# EAGLE design zik-pcb-sbc-ez80stm100p-r3-shield-r1 (EAGLE 6.5.0)
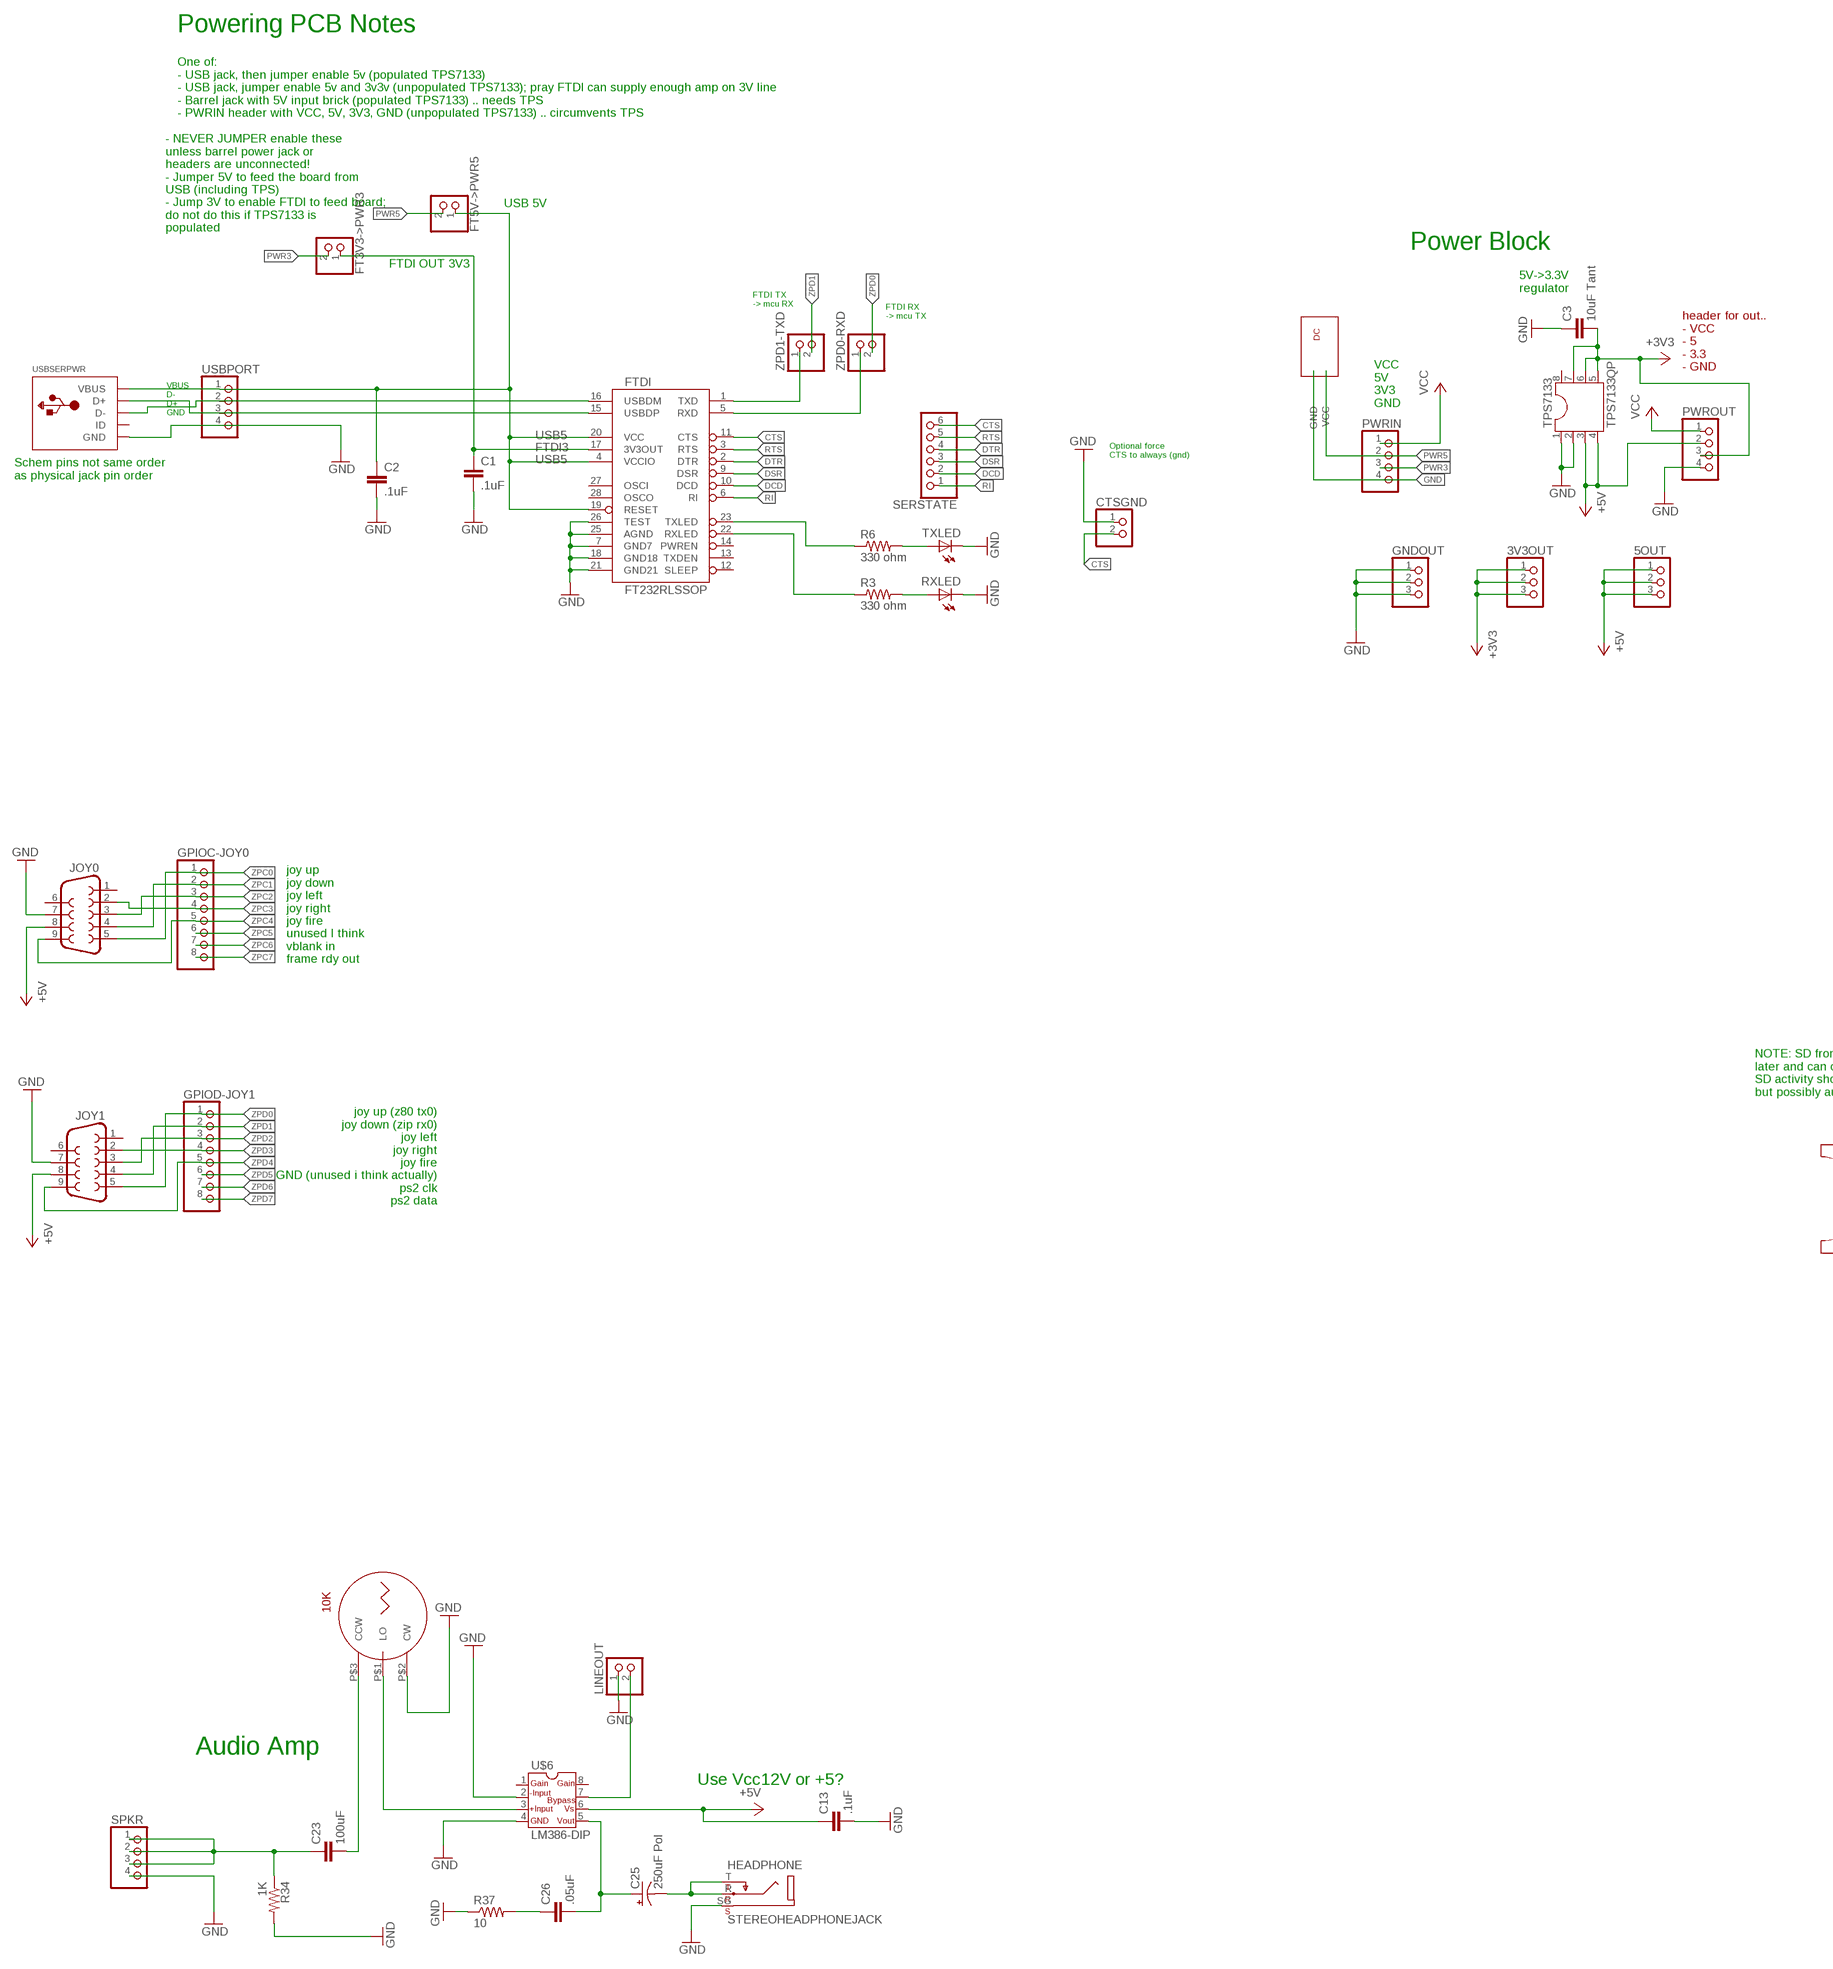
[diagram p0: schematic, sheet 1, part 1 of 3]
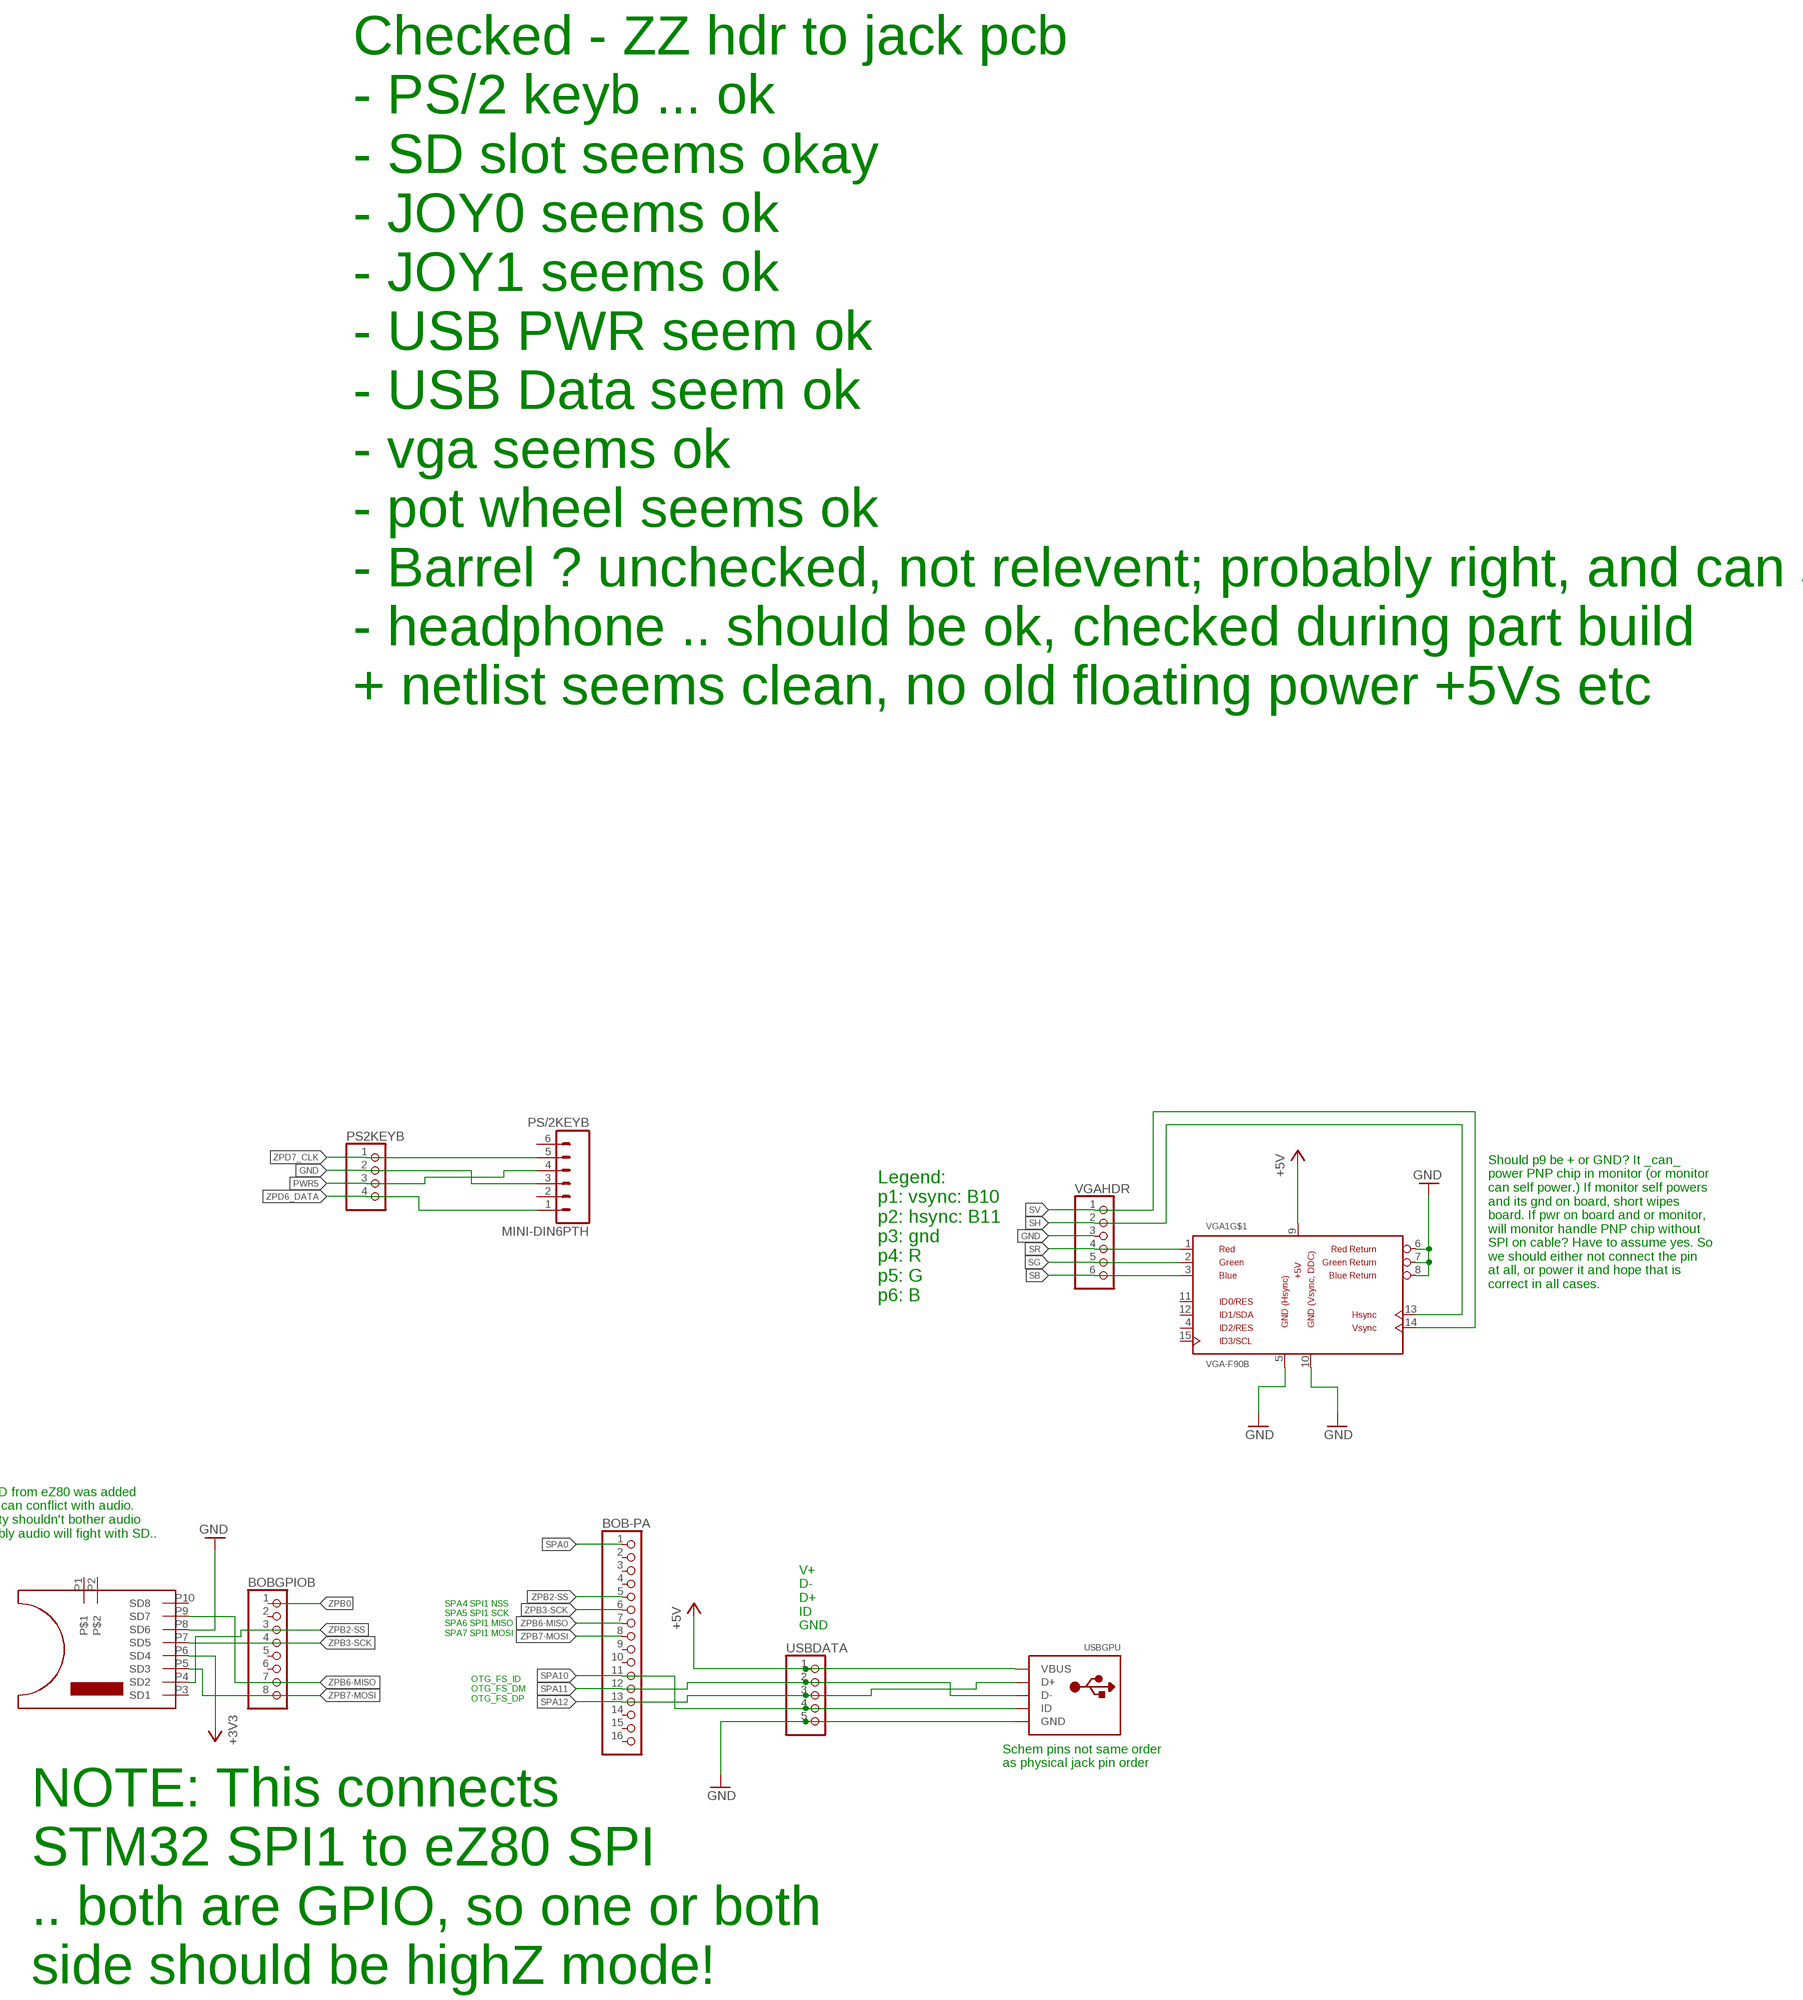
[diagram p1: schematic, sheet 1, part 2 of 3]
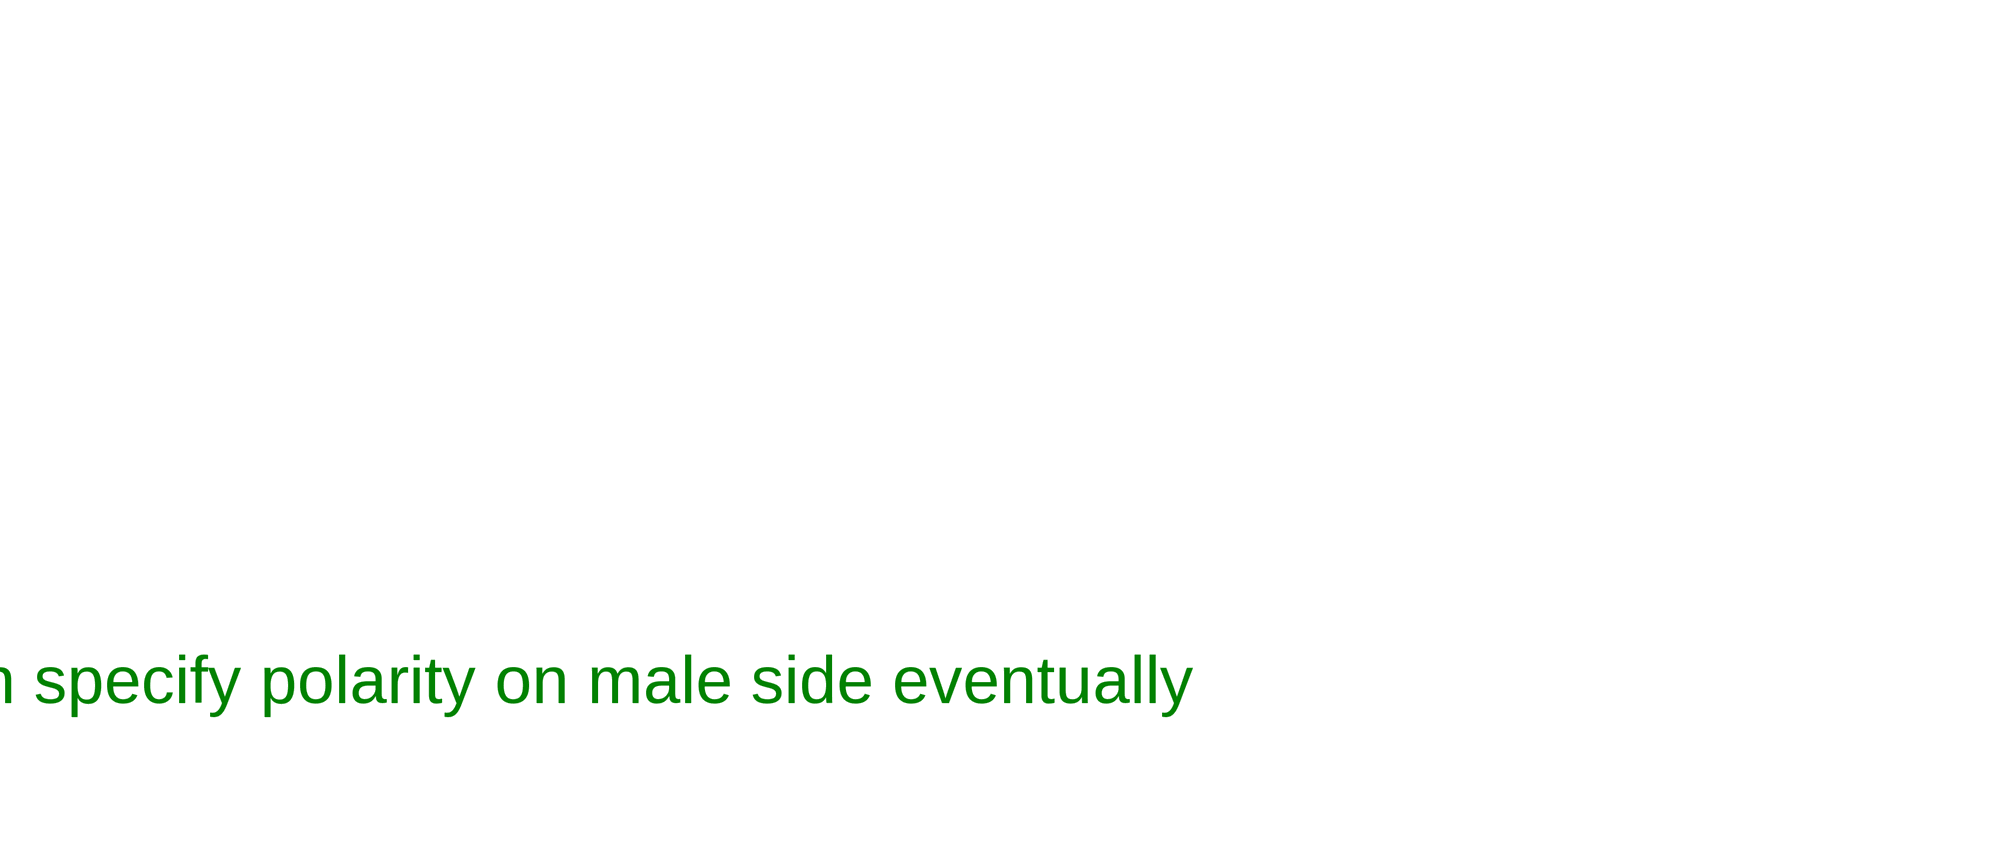
[diagram p2: schematic, sheet 1, part 3 of 3]

## Parts
3V3OUT  PINHD-1X3  [1X03]
5OUT  PINHD-1X3  [1X03]
BARREL  DCJACKZIK  [DCJACKZIK]
BOB-PA  PINHD-1X16  [1X16]
BOBGPIOB  PINHD-1X8  [1X08]
C1  .1uF  C-EU025-025X050  [C025-025X050]
C2  .1uF  C-EU025-025X050  [C025-025X050]
C3  10uF Tant  C-EU025-025X050  [C025-025X050]
C13  .1uF  C-EU025-025X050  [C025-025X050]
C23  100uF  C-EU025-025X050  [C025-025X050]
C25  250uF Pol  CPOL-USE3.5-8  [E3,5-8]
C26  .05uF  C-EU025-025X050  [C025-025X050]
CTSGND  PINHD-1X2  [1X02]
FT3V3->PWR3  PINHD-1X2  [1X02]
FT5V->PWR5  PINHD-1X2  [1X02]
FTDI  FT232RLSSOP  [SSOP28DB]
GNDOUT  PINHD-1X3  [1X03]
GPIOC-JOY0  PINHD-1X8  [1X08]
GPIOD-JOY1  PINHD-1X8  [1X08]
HEADPHONE  STEREOHEADPHONEJACK  [STEREOHEADPHONEJACK]
JOY0  DB9FEMALE  [DB9]
JOY1  DB9FEMALE  [DB9]
LINEOUT  PINHD-1X2  [1X02]
PS2KEYB  PINHD-1X4  [1X04]
PS/2KEYB  MINI-DIN6PTH  [MINI-DIN6]
PWRIN  PINHD-1X4  [1X04]
PWROUT  PINHD-1X4  [1X04]
R3  330 ohm  R-US_0204/7  [0204/7]
R6  330 ohm  R-US_0204/7  [0204/7]
R34  1K  R-US_0204/7  [0204/7]
R37  10  R-US_0204/7  [0204/7]
RXLED  LED5MM  [LED5MM]
SERSTATE  PINHD-1X6  [1X06]
SPKR  PINHD-1X4  [1X04]
TPS7133  TPS7133QP  DIL8  [DIL08]
TXLED  LED5MM  [LED5MM]
U$2  MICROSD10  [MICROSD10]
U$3  10K  POTWHEEL  [POTWHEEL]
U$6  LM386-DIP  [LM386-DIP8]
USBDATA  PINHD-1X5  [1X05]
USBGPU  USBMICRO_20329  [4UCONN_20329]
USBPORT  PINHD-1X4  [1X04]
USBSERPWR  USBMICRO_20329  [4UCONN_20329]
VGA1  VGA-F90B  [DB-15-F90+SHIELD-BIG_PADS]
VGAHDR  PINHD-1X6  [1X06]
ZPD0-RXD  PINHD-1X2  [1X02]
ZPD1-TXD  PINHD-1X2  [1X02]

## Nets
CTS: CTSGND.2 FTDI.11(CTS) SERSTATE.6
DCD: FTDI.10(DCD) SERSTATE.2
DSR: FTDI.9(DSR) SERSTATE.3
DTR: FTDI.2(DTR) SERSTATE.4
FTDI3 [power]: C1.1 FT3V3->PWR3.1 FTDI.17(3V3OUT)
GND [power]: BARREL.JACKET(GND) C1.2 C2.2 C3.1 C13.2 CTSGND.1 FTDI.7(GND7) FTDI.18(GND18) FTDI.21(GND21) FTDI.25(AGND) FTDI.26(TEST) GNDOUT.1 GNDOUT.2 GNDOUT.3 HEADPHONE.SG(S) JOY0.7 JOY1.7 LINEOUT.1 PS2KEYB.2 PS/2KEYB.3 PWRIN.4 PWROUT.4 R34.2 R37.1 RXLED.K(C) SPKR.4 TPS7133.1 TPS7133.2 TXLED.K(C) U$2.P8(SD6) U$3.P$2(CW) U$6.2 U$6.4 USBDATA.5 USBGPU.BASE@1(GND) USBGPU.BASE@2(GND) USBGPU.GND USBGPU.SPRT@1(GND) USBGPU.SPRT@2(GND) USBGPU.SPRT@3(GND) USBGPU.SPRT@4(GND) USBPORT.4 USBSERPWR.BASE@1(GND) USBSERPWR.BASE@2(GND) USBSERPWR.GND USBSERPWR.SPRT@1(GND) USBSERPWR.SPRT@2(GND) USBSERPWR.SPRT@3(GND) USBSERPWR.SPRT@4(GND) VGA1.5(GND) VGA1.6(VGA-R-) VGA1.7(VGA-G-) VGA1.8(VGA-B-) VGA1.10(GND) VGAHDR.3
N$1: C23.2 U$3.P$3(CCW)
N$2: U$3.P$1(LO) U$6.3
N$3: LINEOUT.2 U$6.7
N$4: R6.2 TXLED.A
N$6: C23.1 R34.1 SPKR.1 SPKR.2 SPKR.3
N$8: FTDI.23(TXLED) R6.1
N$10: R3.2 RXLED.A
N$11: FTDI.22(RXLED) R3.1
N$12: FTDI.1(TXD) ZPD1-TXD.1
N$13: FTDI.5(RXD) ZPD0-RXD.1
N$22: C25.+ C26.2 U$6.5
N$23: C25.- HEADPHONE.R HEADPHONE.T
N$24: C26.1 R37.2
PWR3: 3V3OUT.1 3V3OUT.2 3V3OUT.3 C3.2 FT3V3->PWR3.2 PWRIN.3 PWROUT.3 TPS7133.5 TPS7133.6 TPS7133.7 U$2.P6(SD4) ; supply symbol labelled +3V3
PWR5: 5OUT.1 5OUT.2 5OUT.3 BARREL.CPIN(VCC) C13.1 FT5V->PWR5.2 JOY0.8 JOY1.8 PS2KEYB.3 PS/2KEYB.4 PWRIN.2 PWROUT.2 TPS7133.3 TPS7133.4 U$6.6 USBDATA.1 USBGPU.VBUS VGA1.9(+5V) ; supply symbol labelled +5V
RI: FTDI.6(RI) SERSTATE.1
RTS: FTDI.3(RTS) SERSTATE.5
SB: VGA1.3(VGA-B) VGAHDR.6
SG: VGA1.2(VGA-G) VGAHDR.5
SH: VGA1.13(VGA-HSYNC) VGAHDR.2
SPA0: BOB-PA.1
SPA10: BOB-PA.11 USBDATA.4 USBGPU.ID
SPA11: BOB-PA.12 USBDATA.2 USBGPU.D-
SPA12: BOB-PA.13 USBDATA.3 USBGPU.D+
SR: VGA1.1(VGA-R) VGAHDR.4
SV: VGA1.14(VGA-VSYNC) VGAHDR.1
USB5: C2.1 FT5V->PWR5.1 FTDI.4(VCCIO) FTDI.19(RESET) FTDI.20(VCC) USBPORT.1 USBSERPWR.VBUS
USB_D+: FTDI.15(USBDP) USBPORT.3 USBSERPWR.D+
USB_D-: FTDI.16(USBDM) USBPORT.2 USBSERPWR.D-
VCC: PWRIN.1 PWROUT.1
ZPB0: BOBGPIOB.1
ZPB2-SS: BOB-PA.5 BOBGPIOB.3 U$2.P4(SD2)
ZPB3-SCK: BOB-PA.6 BOBGPIOB.4 U$2.P7(SD5)
ZPB6-MISO: BOB-PA.7 BOBGPIOB.7 U$2.P9(SD7)
ZPB7-MOSI: BOB-PA.8 BOBGPIOB.8 U$2.P5(SD3)
ZPC0: GPIOC-JOY0.1 JOY0.5
ZPC1: GPIOC-JOY0.2 JOY0.4
ZPC2: GPIOC-JOY0.3 JOY0.3
ZPC3: GPIOC-JOY0.4 JOY0.2
ZPC4: GPIOC-JOY0.5 JOY0.9
ZPC5: GPIOC-JOY0.6
ZPC6: GPIOC-JOY0.7
ZPC7: GPIOC-JOY0.8
ZPD0: GPIOD-JOY1.1 JOY1.5 ZPD0-RXD.2
ZPD1: GPIOD-JOY1.2 JOY1.4 ZPD1-TXD.2
ZPD2: GPIOD-JOY1.3 JOY1.3
ZPD3: GPIOD-JOY1.4 JOY1.2
ZPD4: GPIOD-JOY1.5 JOY1.9
ZPD5: GPIOD-JOY1.6
ZPD6: GPIOD-JOY1.7
ZPD6_DATA: PS2KEYB.4 PS/2KEYB.1
ZPD7: GPIOD-JOY1.8
ZPD7_CLK: PS2KEYB.1 PS/2KEYB.5
Unconnected: BOB-PA.2 BOB-PA.3 BOB-PA.4 BOB-PA.9 BOB-PA.10 BOB-PA.14 BOB-PA.15 BOB-PA.16 BOBGPIOB.2 BOBGPIOB.5 BOBGPIOB.6 FTDI.12(SLEEP) FTDI.13(TXDEN) FTDI.14(PWREN) FTDI.27(OSCI) FTDI.28(OSCO) JOY0.1 JOY0.6 JOY1.1 JOY1.6 PS/2KEYB.2 PS/2KEYB.6 TPS7133.8 U$2.P1 U$2.P2 U$2.P3(SD1) U$2.P10(SD8) U$6.1 U$6.8 USBSERPWR.ID VGA1.4(ID2/RES) VGA1.11(ID0/RES) VGA1.12(ID1/SDA) VGA1.15(ID3/SCL) VGA1.SHIELD@1(SHIELD) VGA1.SHIELD@2(SHIELD)

## Notes on the sheet
- Powering PCB Notes
- One of:
  - USB jack, then jumper enable 5v (populated TPS7133)
  - USB jack, jumper enable 5v and 3v3v (unpopulated TPS7133); pray FTDI can supply enough amp on 3V line
  - Barrel jack with 5V input brick (populated TPS7133) .. needs TPS
  - PWRIN header with VCC, 5V, 3V3, GND (unpopulated TPS7133) .. circumvents TPS
- USB 5V
- - NEVER JUMPER enable these
  unless barrel power jack or
  headers are unconnected!
  - Jumper 5V to feed the board from
  USB (including TPS)
  - Jump 3V to enable FTDI to feed board;
  do not do this if TPS7133 is
  populated
- Power Block
- FTDI OUT 3V3
- 5V->3.3V
  regulator
- FTDI TX
  -> mcu RX
- FTDI RX
  -> mcu TX
- Checked - ZZ hdr to jack pcb
  - PS/2 keyb ... ok
  - SD slot seems okay
  - JOY0 seems ok
  - JOY1 seems ok
  - USB PWR seem ok
  - USB Data seem ok
  - vga seems ok
  - pot wheel seems ok
  - Barrel ? unchecked, not relevent; probably right, and can specify polarity on male side eventually
  - headphone .. should be ok, checked during part build
  + netlist seems clean, no old floating power +5Vs etc
- header for out..
  - VCC
  - 5
  - 3.3
  - GND
- VCC
  5V
  3V3
  GND
- VBUS
  D-
  D+
  GND
- Optional force
  CTS to always (gnd)
- Schem pins not same order
  as physical jack pin order
- Should p9 be + or GND? It _can_
  power PNP chip in monitor (or monitor
  can self power.) If monitor self powers
  and its gnd on board, short wipes
  board. If pwr on board and or monitor,
  will monitor handle PNP chip without
  SPI on cable? Have to assume yes. So
  we should either not connect the pin
  at all, or power it and hope that is
  correct in all cases.
- Legend:
  p1: vsync: B10
  p2: hsync: B11
  p3: gnd
  p4: R
  p5: G
  p6: B
- joy up
  joy down
  joy left
  joy right
  joy fire
  unused I think
  vblank in
  frame rdy out
- NOTE: SD from eZ80 was added
  later and can conflict with audio.
  SD activity shouldn't bother audio
  but possibly audio will fight with SD..
- V+
  D-
  D+
  ID
  GND
- SPA4 SPI1 NSS
  SPA5 SPI1 SCK
  SPA6 SPI1 MISO
  SPA7 SPI1 MOSI
- joy up (z80 tx0)
  joy down (zip rx0)
  joy left
  joy right
  joy fire
  GND (unused i think actually)
  ps2 clk
  ps2 data
- OTG_FS_ID 
  OTG_FS_DM 
  OTG_FS_DP
- Schem pins not same order
  as physical jack pin order
- NOTE: This connects
  STM32 SPI1 to eZ80 SPI
  .. both are GPIO, so one or both
  side should be highZ mode!
- Audio Amp
- Use Vcc12V or +5?

## Library data of the parts
3V3OUT 5OUT GNDOUT = pinhead:PINHD-1X3: PIN HEADER
BARREL = skeezix:DCJACKZIK
BOB-PA = pinhead:PINHD-1X16: PIN HEADER
BOBGPIOB GPIOC-JOY0 GPIOD-JOY1 = pinhead:PINHD-1X8: PIN HEADER
C1-C3 C13 C23 C26 = rcl:C-EU: CAPACITOR, European symbol
C25 = rcl:CPOL-US: POLARIZED CAPACITOR, American symbol
CTSGND FT3V3->PWR3 FT5V->PWR5 LINEOUT ZPD0-RXD ZPD1-TXD = pinhead:PINHD-1X2: PIN HEADER
FTDI = SparkFun:FT232RL: USB UART FT232RL 4th Generation USB UART (USB <-> Serial) Controller. Spark Fun Electronics SKU : COM-00650
HEADPHONE = skeezix:STEREOHEADPHONEJACK
JOY0 JOY1 = SparkFun-Connectors-skeemod:DB9: DB9 Connector Standard DB9 (D-Sub 9) serial connector. Can be used for CAN bus as well as RS485 and RS232. Footprint production proven. Spark Fun Electronics SKU : PRT-00429
PS2KEYB PWRIN PWROUT SPKR USBPORT = pinhead:PINHD-1X4: PIN HEADER
PS/2KEYB = SparkFun-Connectors-skeemod:MINI-DIN6: mini DIN 6 Connector Commonly found on the back of a computer for PS2 keyboard and mice. Schematic and footprint are proven. Spark Fun Electronics SKU : PRT-08509
R3 R6 R34 R37 = rcl:R-US_: RESISTOR, American symbol
RXLED TXLED = SparkFun-LED:LED: LEDs Standard schematic elements and footprints for 5mm, 3mm, 1206, and 0603 sized LEDs. 5mm - Spark Fun Electronics SKU : COM-00529 (and others)
SERSTATE VGAHDR = pinhead:PINHD-1X6: PIN HEADER
TPS7133 = ic-package:DIL8: Dual In Line / Socket
U$2 = skeezix:MICROSD10
U$3 = skeezix:POTWHEEL
U$6 = skeezix:LM386-DIP: LM386 audio amp DIP8 package
USBDATA = pinhead:PINHD-1X5: PIN HEADER
USBGPU USBSERPWR = adafruit-musb-skeemod:USB: USB Connectors USBMINIB - Surface Mount Female Mini-B USB Connector 4UConnector: 06564
VGA1 = VideoConnectors-skeemod:VGA-*

## Net classes
1 power: width 0.254 mm

## Board
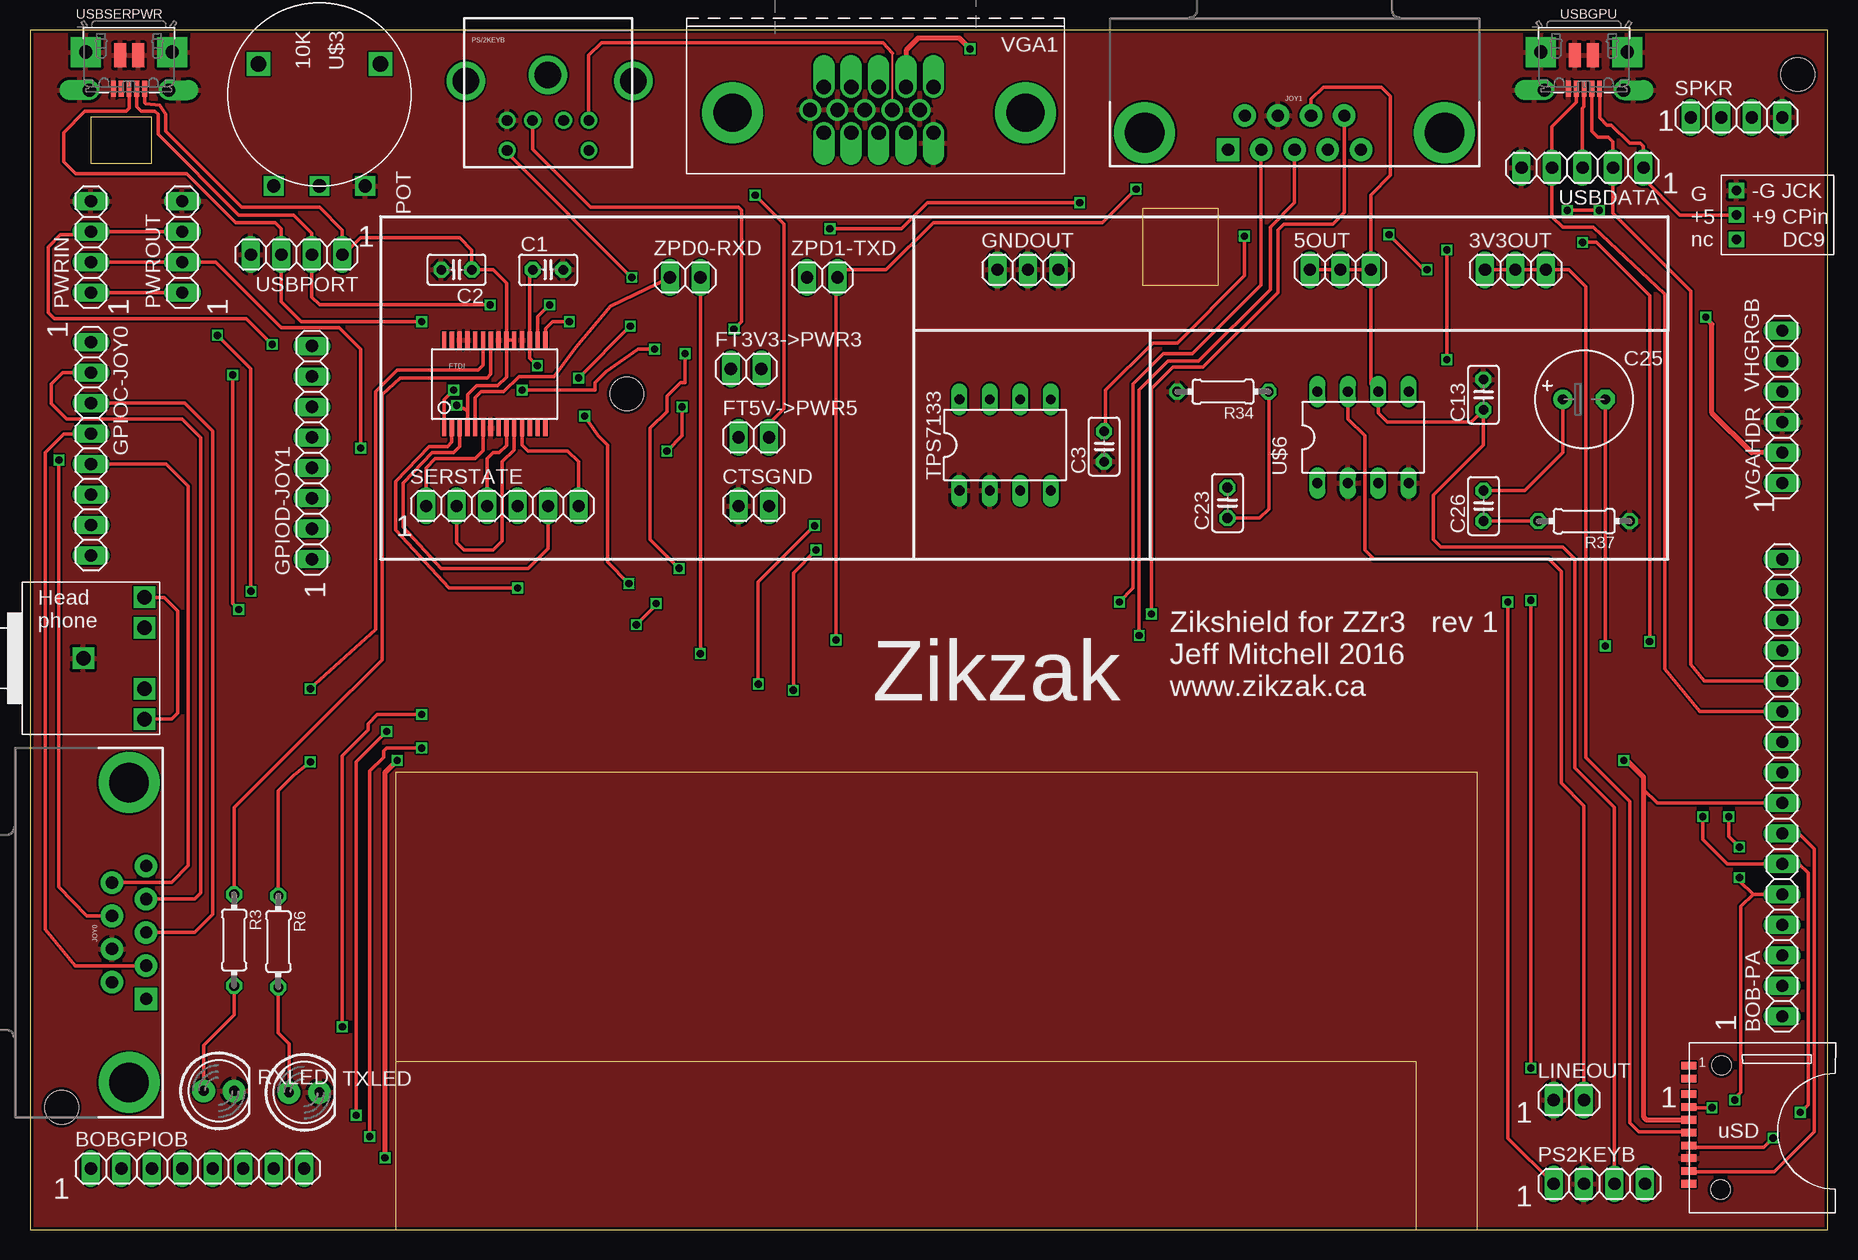
[diagram p3: board, top side]
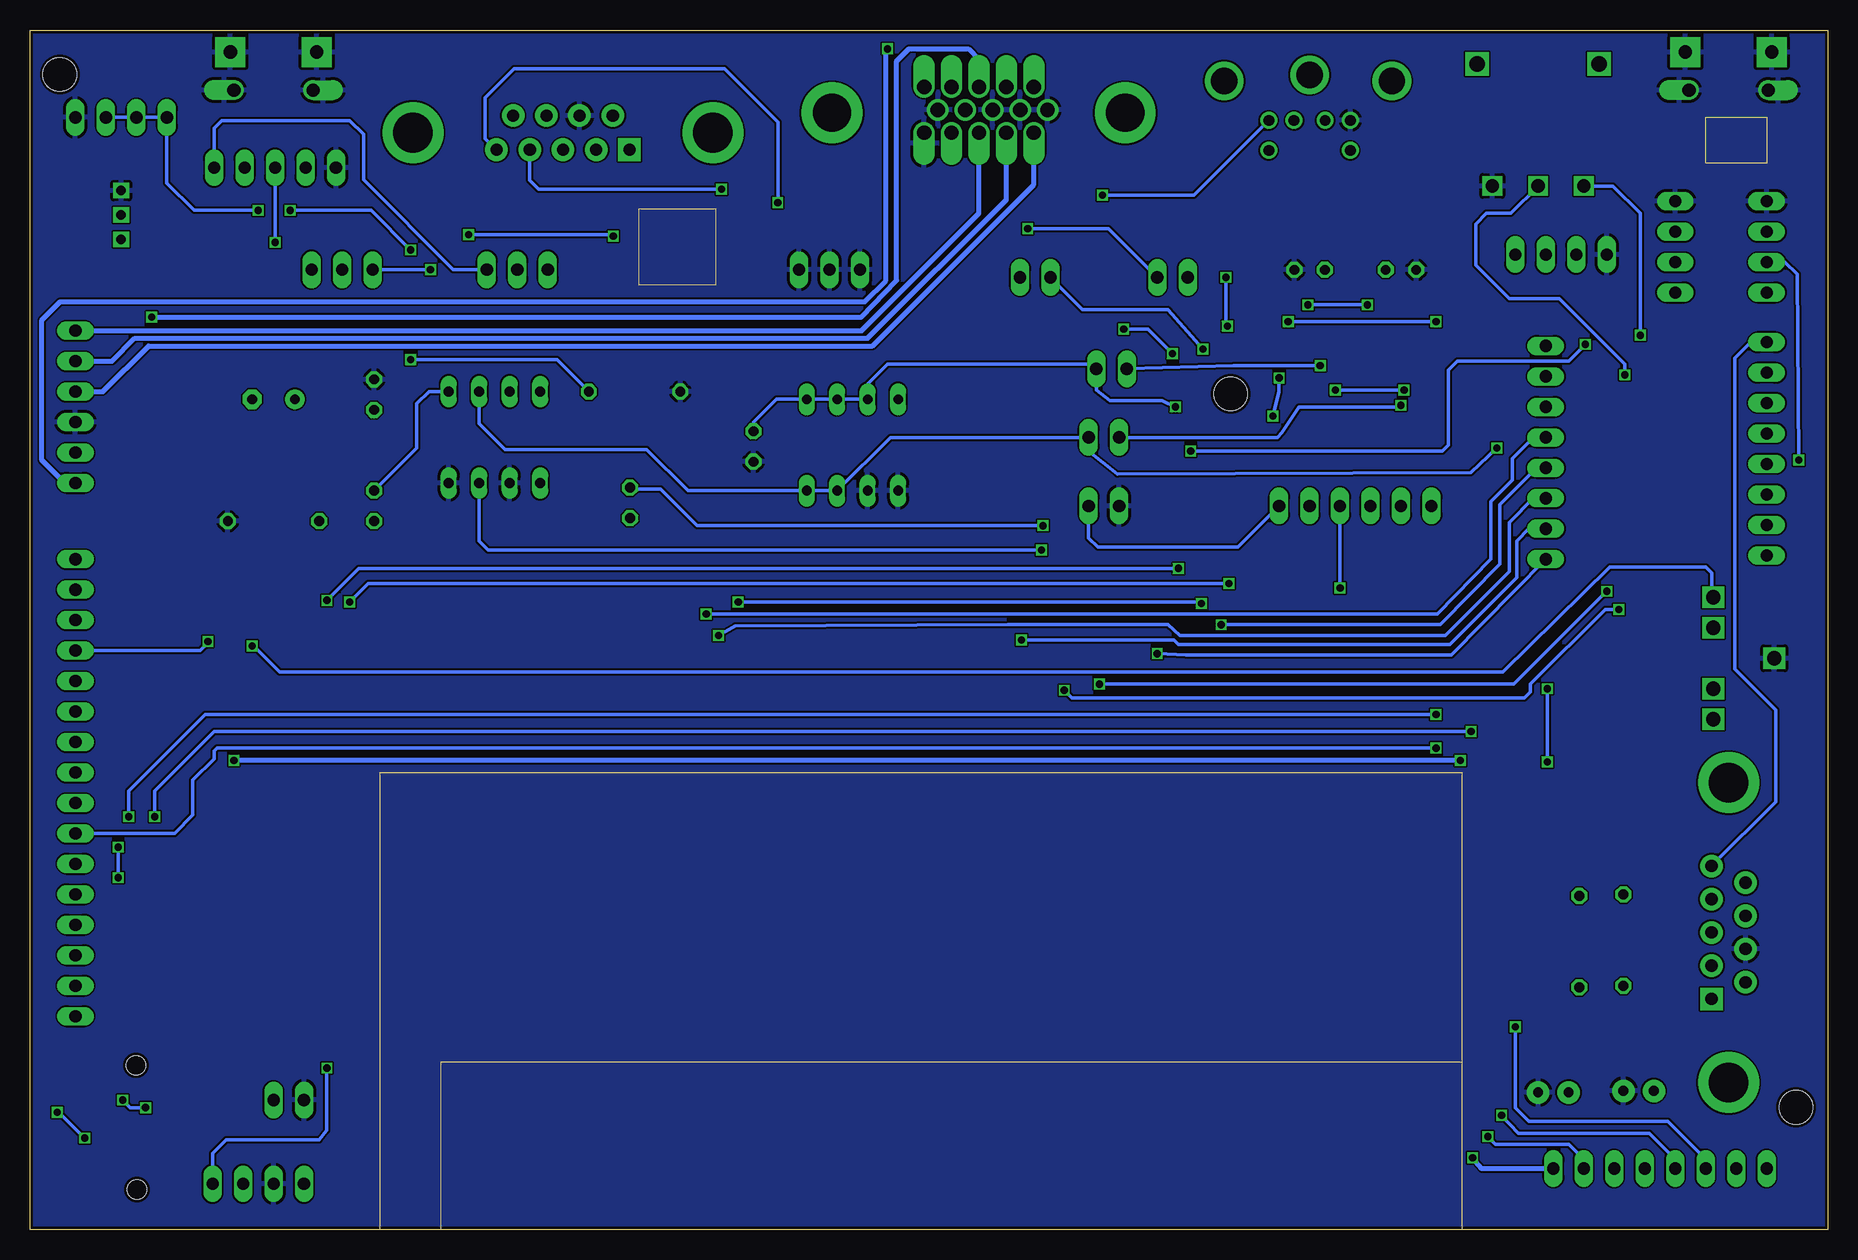
[diagram p4: board, bottom side, seen from below]

Size 149.84 x 100 mm. Coordinates in mm from the lower left corner, seen from the top.
Outline: 0,0 149.84,0 149.84,100 0,100 0,0
Copper layers (1*16): Top 0.035mm / dielectric 1.5mm / Bottom 0.035mm
Design rules "Elecrow_2-layer_eagle_rule": minimum track width 6mil, minimum drill 12mil, track to track 6mil, track to pad 6mil, pad to pad 6mil, via to via 6mil, smd to smd 0mil, copper to edge 10mil, drill to drill 10mil, minimum pad ring 10mil, minimum via ring 6mil, stop-mask expansion 2mil, vias tented up to drill 100mil, thermal gap 10mil
Holes 2.8 mm at 49.75,69.66 147.35,96.3 2.64,10.19
Milling: area 30.5,0 to 115.6,14; area 30.5,0 to 120.7,38.1; area 92.7,78.7 to 99.1,85.1; area 5.1,88.9 to 10.2,92.7

### Footprints (pad centres in the part's own frame; a part is rotated, then mirrored left to right if it is on the bottom)
1X03 = drill 1.016 long: 1 -2.54,0; 2 0,0; 3 2.54,0
DCJACKZIK = drill 0.8 square: CPIN 1.27,3.302; JACKET 1.27,5.334; UNUSED 1.27,1.27
1X16 = drill 1.016 long: 1 -19.05,0; 2 -16.51,0; 3 -13.97,0; 4 -11.43,0; 5 -8.89,0; 6 -6.35,0; 7 -3.81,0; 8 -1.27,0; 9 1.27,0; 10 3.81,0; 11 6.35,0; 12 8.89,0; 13 11.43,0; 14 13.97,0; 15 16.51,0; 16 19.05,0
1X08 = drill 1.016 long: 1 -8.89,0; 2 -6.35,0; 3 -3.81,0; 4 -1.27,0; 5 1.27,0; 6 3.81,0; 7 6.35,0; 8 8.89,0
C025-025X050 = drill 0.813 octagon: 1 -1.27,0; 2 1.27,0
E3,5-8 = drill 0.813 pad 1.6: + -1.778,0 | drill 0.813 pad 1.6 octagon: - 1.778,0
1X02 = drill 1.016 long: 1 -1.27,0; 2 1.27,0
SSOP28DB = smd 0.348 x 1.397: 1 -4.225,-3.656; 2 -3.575,-3.656; 3 -2.925,-3.656; 4 -2.275,-3.656; 5 -1.625,-3.656; 6 -0.975,-3.656; 7 -0.325,-3.656; 8 0.325,-3.656; 9 0.975,-3.656; 10 1.625,-3.656; 11 2.275,-3.656; 12 2.925,-3.656; 13 3.575,-3.656; 14 4.225,-3.656; 15 4.225,3.656; 16 3.575,3.656; 17 2.925,3.656; 18 2.275,3.656; 19 1.625,3.656; 20 0.975,3.656; 21 0.325,3.656; 22 -0.325,3.656; 23 -0.975,3.656; 24 -1.625,3.656; 25 -2.275,3.656; 26 -2.925,3.656; 27 -3.575,3.656; 28 -4.225,3.656
STEREOHEADPHONEJACK = drill 1.2 square: R 11.43,11.43; RS 11.43,8.89; SG 6.35,6.35; T 11.43,1.27; TS 11.43,3.81
DB9 = drill 1.016 pad 1.88 square: 1 -5.54,-1.42 | drill 1.016 pad 1.88: 2 -2.77,-1.42; 3 0,-1.42; 4 2.77,-1.42; 5 5.54,-1.42; 6 -4.15,1.42; 7 -1.38,1.42; 8 1.38,1.42; 9 4.15,1.42 | drill 3.302 pad 5.08: G1 -12.5,0; G2 12.5,0
1X04 = drill 1.016 long: 1 -3.81,0; 2 -1.27,0; 3 1.27,0; 4 3.81,0
MINI-DIN6 = drill 0.9: 1 -1.3,-8.5; 2 1.3,-8.5; 3 -3.4,-8.5; 4 3.4,-8.5; 5 -3.4,-11; 6 3.4,-11 | drill 2.2: P$1 0,-4.7; P$2 7.112,-5.208; P$3 -6.858,-5.208
0204/7 = drill 0.813 octagon: 1 -3.81,0; 2 3.81,0
LED5MM = drill 0.813 pad 1.88: A -1.27,0; K 1.27,0
1X06 = drill 1.016 long: 1 -6.35,0; 2 -3.81,0; 3 -1.27,0; 4 1.27,0; 5 3.81,0; 6 6.35,0
DIL08 = drill 0.813 long: 1 -3.81,-3.81; 2 -1.27,-3.81; 3 1.27,-3.81; 4 3.81,-3.81; 5 3.81,3.81; 6 1.27,3.81; 7 -1.27,3.81; 8 -3.81,3.81
MICROSD10 = smd 1.27 x 0.635: P1 12.217,1.575; P2 12.217,2.642; P3 12.217,3.962; P4 12.217,5.029; P5 12.217,6.096; P6 12.217,7.163; P7 12.217,8.23; P8 12.217,9.296; P9 12.217,10.363; P10 12.217,11.43 | hole 1.6: 9.5,1.549; 9.576,11.913
POTWHEEL = drill 1.1 square: P$1 15.24,6.35; P$2 15.24,10.16; P$3 15.24,2.54 | drill 1.3 square: P$4 5.08,11.43; P$5 5.08,1.27
LM386-DIP8 = drill 0.813 long: 1 0,-1.27; 2 2.54,-1.27; 3 5.08,-1.27; 4 7.62,-1.27; 5 7.62,6.35; 6 5.08,6.35; 7 2.54,6.35; 8 0,6.35
1X05 = drill 1.016 long: 1 -5.08,0; 2 -2.54,0; 3 0,0; 4 2.54,0; 5 5.08,0
4UCONN_20329 = smd 1 x 2: BASE@1 -0.75,-2; BASE@2 0.75,-2 | smd 0.4 x 1.35: D+ 0,0.775; D- -0.65,0.775; GND 1.3,0.775; ID 0.65,0.775; VBUS -1.3,0.775 | drill 1.1 offset: SPRT@1 -3.3,0.9; SPRT@2 3.3,0.9 | drill 1.1 pad 2.5 square: SPRT@3 -3.6,-2.281; SPRT@4 3.6,-2.281
DB-15-F90+SHIELD-BIG_PADS = drill 1.194 offset: 1 4.318,13.335; 2 2.032,13.335; 3 -0.254,13.335; 4 -2.54,13.335; 5 -4.826,13.335; 11 4.318,9.525; 12 2.032,9.525; 13 -0.254,9.525; 14 -2.54,9.525; 15 -4.826,9.525 | drill 1.194: 6 5.461,11.43; 7 3.175,11.43; 8 0.889,11.43; 9 -1.397,11.43; 10 -3.683,11.43 | drill 3.175 pad 5.08: SHIELD@1 -12.497,11.684; SHIELD@2 11.938,11.684

### Placement (x,y rotation side)
3V3OUT  123.83,80.01 0 top
5OUT  109.22,80.01 0 top
BARREL  140.97,81.28 0 top
BOB-PA  146.05,36.83 90 top
BOBGPIOB  13.97,5.08 0 top
C1  43.18,80.01 0 top
C2  35.56,80.01 180 top
C3  89.53,65.28 90 top
C13  121.16,69.6 90 top
C23  99.82,60.58 90 top
C25  129.54,69.22 0 top
C26  121.16,60.33 90 top
CTSGND  60.33,60.33 0 top
FT3V3->PWR3  59.69,71.75 0 top
FT5V->PWR5  60.33,66.04 0 top
FTDI  38.73,70.48 0 top
GNDOUT  83.19,80.01 0 top
GPIOC-JOY0  5.08,65.09 270 top
GPIOD-JOY1  23.5,64.77 90 top
HEADPHONE  -1.91,41.27 0 top
JOY0  8.26,24.77 90 top
JOY1  105.41,91.44 0 top
LINEOUT  128.27,10.79 0 top
PS2KEYB  130.81,3.81 0 top
PS/2KEYB  43.18,100.97 0 top
PWRIN  5.08,81.92 90 top
PWROUT  12.7,81.92 90 top
R3  17.02,24.13 270 top
R6  20.7,24 270 top
R34  99.44,69.85 180 top
R37  129.54,59.05 180 top
RXLED  15.75,11.56 0 top
SERSTATE  39.37,60.33 0 top
SPKR  142.24,92.71 0 top
TPS7133  81.28,65.41 0 top
TXLED  22.86,11.43 0 top
U$2  150.5,15.24 180 top
U$3  17.78,102.23 270 top
U$6  107.31,63.5 0 top
USBDATA  129.41,88.52 180 top
USBGPU  129.54,95.89 180 top
USBPORT  22.23,81.28 180 top
USBSERPWR  8.26,95.89 180 top
VGA1  70.48,104.78 180 top
VGAHDR  146.05,68.58 90 top
ZPD0-RXD  54.61,79.38 0 top
ZPD1-TXD  66.04,79.38 0 top

### Tracks (layer width: path | path; a pad name or v marks a point on that pad's centre or on a via)
CTS
  Top 0.305: FTDI.11 41.01,65.42 41.53,64.9 44.83,64.9 45.72,64.01 SERSTATE.6
  Bottom 0.305: SERSTATE.6 49.15,56.9 60.83,56.9 61.59,57.66 CTSGND.2
DCD
  Top 0.305: FTDI.10 40.36,65 39.37,64.01 39.37,57.4 38.61,56.64 36.2,56.64 35.56,57.28 SERSTATE.2
DSR
  Top 0.305: FTDI.9 39.71,65.36 39.12,64.77 38.61,64.77 38.1,64.26 SERSTATE.3
DTR  (via drill 0.6)
  Top 0.305: FTDI.2 35.16,65.64 34.8,65.28 33.27,65.28 30.48,62.36 30.48,58.29 34.92,53.47 v40.64,53.47
  Bottom 0.305: v40.64,53.47 SERSTATE.4
FTDI3  (via drill 0.6)
  Top 0.305: C1.1 41.66,79.76 FTDI.17 41.66,72.64 v42.29,72.01
  Bottom 0.305: v42.29,72.01 49.53,72.01 FT3V3->PWR3.1
GND
  pour Bottom: 0,0 0,100.33 149.86,100.33 149.86,0
  pour Top: 0,0 0,100.33 149.86,100.33 149.86,0
N$1  (via drill 0.6)
  Top 0.305: v65.41,58.67 60.71,53.98 v60.71,45.47 | v18.41,53.21 18.41,71.75 v15.62,74.55
  Bottom 0.305: C23.2 99.69,61.72 97.28,61.72 94.23,58.67 v65.41,58.67 | v60.71,45.47 26.16,45.47 v18.41,53.21 | v15.62,74.55 15.62,84.71 17.91,87 U$3.P$3
N$2  (via drill 0.6)
  Top 0.305: v65.53,56.64 63.63,54.74 v63.63,44.96 | v17.4,51.69 16.89,52.2 v16.89,71.25
  Bottom 0.305: U$6.3 112.39,57.4 111.63,56.64 v65.53,56.64 | v63.63,44.96 62.99,44.32 25.27,44.32 24.77,44.83 24.77,45.47 18.54,51.69 v17.4,51.69 | v16.89,71.25 16.89,72.14 22.35,77.6 26.54,77.6 29.34,80.39 29.34,83.82 28.45,84.71 26.42,84.71 U$3.P$1
N$3
  Top 0.305: LINEOUT.2 129.54,35.31 127.64,37.21 127.64,54.86 126.62,55.88 112.01,55.88 111.25,56.64 111.25,66.17 109.86,67.56 U$6.7
N$4
  Top 0.305: TXLED.A 21.59,15.49 20.7,16.38 R6.2
N$6  (via drill 0.6)
  Top 0.305: C23.1 102.49,59.31 103.25,60.07 R34.1 | v118.11,72.52 v118.11,81.66 | v128.14,84.96 v130.81,84.96
  Bottom 0.305: R34.1 105.92,72.52 v118.11,72.52 | v118.11,81.66 121.41,84.96 v128.14,84.96 | v130.81,84.96 136.14,84.96 138.43,87.25 SPKR.1 SPKR.2 SPKR.3
N$8  (via drill 0.6)
  Top 0.305: FTDI.23 37.76,72.05 37.34,71.63 30.61,71.63 28.83,69.85 28.83,50.04 v23.37,45.09 | v23.37,38.99 21.97,37.85 20.7,36.58 R6.1
  Bottom 0.305: v23.37,45.09 v23.37,38.99
N$10
  Top 0.305: RXLED.A 14.48,15.37 17.02,17.91 R3.2
N$11
  Top 0.305: FTDI.22 38.41,71.3 38.1,70.99 30.86,70.99 29.34,69.6 29.34,47.5 24.26,42.42 17.02,35.18 R3.1
N$12  (via drill 0.6)
  Top 0.305: FTDI.1 34.51,69.18 v35.31,69.98 | v41.02,69.98 47.12,69.98 47.12,70.61 48.01,71.5 50.67,73.41 v52.07,73.41
  Bottom 0.305: v35.31,69.98 v41.02,69.98 | v52.07,73.41 54.99,76.71 62.1,76.71 ZPD1-TXD.1
N$13
  Top 0.305: FTDI.5 37.11,69.37 37.59,69.85 39.5,69.85 40.77,71.12 43.69,71.12 45.47,73.53 48.39,76.96 ZPD0-RXD.1
N$22
  Top 0.305: C26.2 124.59,61.59 127.76,64.77 C25.+
  Bottom 0.305: C26.2 117.6,65.15 117.6,68.83 116.59,69.85 U$6.5
N$23  (via drill 0.6)
  Top 0.305: HEADPHONE.T 11.81,42.55 12.32,43.05 12.32,51.56 11.18,52.7 HEADPHONE.R | v131.32,48.64 C25.-
  Bottom 0.305: HEADPHONE.R 9.65,52.83 9.65,54.74 10.16,55.24 18.16,55.24 27.05,46.48 129.03,46.48 131.19,48.64 v131.32,48.64
N$24
  Top 0.305: C26.1 R37.2
PWR3  (via drill 0.6)
  Top 0.305: PWROUT.3 PWRIN.3 4.83,82.93 2.54,82.93 1.52,81.92 1.52,76.45 2.03,75.95 18.03,75.95 v20.19,73.79 | U$2.P6 138.23,8.13 134.11,8.13 133.35,8.89 133.35,35.69 129.67,39.37 129.67,78.61 128.27,80.01 3V3OUT.3 3V3OUT.2 3V3OUT.1 | v53.09,64.9 54.36,66.17 v54.36,68.58 | v116.46,80.01 116.2,80.01 v113.28,82.93 | v101.22,82.8 101.22,79.5 95.63,73.91 93.6,73.91 89.66,69.98 89.66,66.67 C3.2
  Bottom 0.305: v20.19,73.79 21.59,72.39 30.86,72.39 31.62,71.63 31.62,65.41 32.13,64.9 v53.09,64.9 | v54.36,68.58 55.5,69.09 59.82,69.09 60.96,69.98 FT3V3->PWR3.2 61.34,72.14 78.36,72.14 80.01,70.48 TPS7133.7 TPS7133.6 TPS7133.5 87.63,69.22 89.53,67.31 C3.2 | 3V3OUT.1 v116.46,80.01 | v113.28,82.93 101.35,82.93 v101.22,82.8
PWR5  (via drill 0.6)
  Top 0.152: VGA1.9 71.88,98.04
  Top 0.305: PWRIN.2 PWROUT.2 15.49,80.64 20.95,75.18 25.78,75.18 27.56,73.41 v27.56,65.15 | 5OUT.3 111.76,70.48 U$6.6 112.39,68.07 113.16,67.31 120.14,67.31 C13.1 121.16,65.41 116.97,61.21 116.97,57.53 117.6,56.9 127.76,56.9 128.78,55.88 128.78,38.48 132.08,35.18 PS2KEYB.3 | 5OUT.3 111.76,86.23 113.41,87.88 113.41,94.49 112.65,95.25 107.82,95.25 106.79,94.22 JOY1.8 | USBGPU.VBUS 130.84,92.68 131.44,92.08 131.83,92.08 133.35,90.55 134.24,90.55 134.49,90.3 USBDATA.1 134.49,87.63 137.54,84.58 BARREL.CPIN | JOY0.8 4.72,26.14 2.41,28.57 v2.41,64.14 | 71.88,98.04 71.12,98.93 47.62,98.93 46.58,97.89 PS/2KEYB.4 | v60.45,86.23 62.87,83.82 62.87,68.45 61.59,67.18 FT5V->PWR5.2 | 5OUT.1 5OUT.2 5OUT.3
  Bottom 0.305: 106.81,92.84 JOY1.8 | v2.41,64.14 2.54,79.63 3.56,80.64 PWRIN.2 | PS/2KEYB.4 52.81,86.23 v60.45,86.23 | v27.56,65.15 29.72,63.12 59.18,62.99 61.59,64.9 FT5V->PWR5.2 78.11,66.04 TPS7133.3 TPS7133.4 95,61.59 98.42,65.02 110.24,65.02 112.39,67.18 U$6.6 | USBDATA.1 134.49,91.82 133.86,92.46 123.19,92.46 122.05,91.31 122.05,87.5 114.55,80.01 5OUT.3
RI
  Top 0.305: FTDI.6 37.76,64.94 37.08,64.26 33.78,64.26 33.02,63.5 SERSTATE.1
RTS
  Top 0.305: FTDI.3 35.81,65.27 35.31,64.77 33.53,64.77 31.11,62.23 31.11,58.55 34.29,55.12 41.53,55.12 43.18,56.77 SERSTATE.5
SB
  Bottom 0.406: VGAHDR.6 80.52,74.93 70.74,84.71 VGA1.3
SG
  Bottom 0.406: VGAHDR.5 143,72.39 141.1,74.3 80.01,74.3 68.45,85.85 VGA1.2
SH  (via drill 0.6)
  Top 0.406: VGAHDR.2 143.51,64.77 140.21,68.07 140.21,75.44 v139.7,76.07
  Bottom 0.406: v139.7,76.07 80.52,76.07 77.6,79.12 77.6,97.41 76.58,98.42 71.63,98.42 70.74,97.54 VGA1.13
SPA10
  Top 0.305: USBGPU.ID 128.89,93.97 126.87,91.95 USBDATA.4 126.87,84.45 127.76,83.57 130.3,83.57 136.27,77.98 136.27,46.74 139.19,43.18 BOB-PA.11
SPA11
  Top 0.305: USBGPU.D- 130.19,91.55 130.68,91.06 131.57,91.06 131.95,90.68 USBDATA.2 131.95,84.71 138.43,78.23 138.43,47.12 139.57,45.72 BOB-PA.12
SPA12  (via drill 0.6)
  Top 0.305: USBGPU.D+ 129.54,93.6 129.41,93.47 USBDATA.3 | v135,49.02 135,77.85 130.56,82.3 v129.41,82.3
  Bottom 0.305: BOB-PA.13 135.64,48.26 135,48.9 v135,49.02 | v129.41,82.3 USBDATA.3
SR
  Bottom 0.406: VGAHDR.4 143.76,69.85 139.95,73.66 79.63,73.66 66.17,87.12 VGA1.1
SV  (via drill 0.6)
  Top 0.406: v78.36,98.42 77.47,99.31 74.04,99.31 73.03,98.3 VGA1.14
  Bottom 0.406: VGAHDR.1 146.94,62.23 148.84,64.14 148.84,75.82 147.32,77.34 80.26,77.34 78.49,79.12 78.49,98.3 v78.36,98.42
USB5  (via drill 0.6)
  Top 0.305: FTDI.20 39.71,78.91 38.61,80.01 C2.1 36.83,81.66 35.81,82.68 27.56,82.68 26.16,81.28 USBPORT.1 26.04,83.31 24.13,85.22 17.65,85.22 11.3,91.57 11.3,92.96 10.79,93.73 9.65,93.85 9.55,93.95 USBSERPWR.VBUS | FTDI.20 FTDI.19 | FTDI.4 36.46,68.2 | 36.46,68.2 36.46,69.61 37.21,70.36 38.99,70.36 39.71,71.08 FTDI.20 | v35.56,68.71 36.21,68.45 36.46,68.2
  Bottom 0.305: v35.56,68.71 35.69,68.58 44.07,68.58 45.47,66.42 45.85,66.04 FT5V->PWR5.1
USB_D+  (via drill 0.6)
  Top 0.305: FTDI.15 42.96,75.09 43.56,75.69 v44.96,75.69 | v32.64,75.69 22.61,75.69 20.95,77.34 USBPORT.3 20.95,83.44 20.45,83.95 17.14,83.95 13.08,88.01 3.81,88.01 2.79,89.03 2.79,91.44 4.57,93.22 8,93.22 8.26,93.47 USBSERPWR.D+
  Bottom 0.305: v44.96,75.69 v32.64,75.69
USB_D-  (via drill 0.6)
  Top 0.305: FTDI.16 42.31,76.09 v43.31,77.09 | v38.35,77.09 24.13,77.09 23.5,77.72 USBPORT.2 23.5,83.06 21.97,84.58 17.4,84.58 10.67,91.31 10.67,92.96 10.41,93.22 9.27,93.22 8.89,93.6 8.89,95.09 USBSERPWR.D-
  Bottom 0.305: v43.31,77.09 v38.35,77.09
VCC
  Top 0.305: PWRIN.1 PWROUT.1
ZPB2-SS  (via drill 0.6)
  Top 0.305: BOB-PA.5 143.64,27.94 | 143.64,27.94 142.62,26.92 142.62,11.43 142.11,10.92 v142.11,10.79 | v140.21,10.16 138.33,10.16 U$2.P4 | v26.04,16.89 26.04,39.5 28.19,41.66 28.19,42.16 28.96,42.93 v32.64,42.93 | v141.6,34.42 141.6,32.77 v142.49,31.88 | v142.49,29.34 142.49,29.08 143.64,27.94
  Bottom 0.305: BOBGPIOB.3 10.16,5.84 13.34,9.02 24.89,9.02 26.04,10.16 v26.04,16.89 | v32.64,42.93 135.25,42.93 141.6,36.58 v141.6,34.42 | v142.49,31.88 v142.49,29.34 | v140.21,10.16 141.48,10.16 v142.11,10.79
ZPB3-SCK  (via drill 0.6)
  Top 0.305: U$2.P7 138.43,6.86 144.53,6.86 v145.29,7.62 | v27.18,9.53 27.18,38.99 v29.72,41.53 | v139.45,34.42 139.45,32.51 141.48,30.48 BOB-PA.6 147.45,30.48 148.21,29.72 148.21,10.41 v147.57,9.78
  Bottom 0.305: BOBGPIOB.4 12.7,5.84 14.86,8 25.78,8 v27.18,9.53 | v29.72,41.53 134.49,41.53 139.45,36.58 v139.45,34.42 | v147.57,9.78 147.45,9.78 v145.29,7.62
ZPB6-MISO  (via drill 0.6)
  Top 0.305: BOB-PA.7 147.45,33.02 148.72,31.75 148.72,8.13 145.41,4.83 138.33,4.83 U$2.P9 | v28.32,7.75 28.32,38.23 29.46,39.37 29.46,39.88 29.72,40.13 v32.64,40.13
  Bottom 0.305: BOBGPIOB.7 20.32,5.84 21.59,7.11 27.69,7.11 v28.32,7.75 | v32.64,40.13 134.24,40.13 134.49,39.88 134.49,39.24 136.27,37.47 136.27,34.54 137.79,33.02 BOB-PA.7
ZPB7-MOSI  (via drill 0.6)
  Top 0.305: BOB-PA.8 135.64,35.56 134.49,36.7
  Top 0.406: v29.59,5.97 29.59,38.1 v30.61,39.12 | v132.84,39.12 133.1,39.12 134.49,37.72 134.49,36.7 134.49,9.4 134.75,9.14 U$2.P5
  Bottom 0.406: BOBGPIOB.8 28.83,5.08 v29.59,5.97 | v30.61,39.12 v132.84,39.12
ZPC0
  Bottom 0.305: JOY0.5 4.32,35.66 4.32,43.31 7.75,46.74 7.75,72.64 6.41,73.98 GPIOC-JOY0.1
ZPC1
  Top 0.305: JOY0.4 9.7,27.56 13.72,27.56 14.22,28.07 14.22,66.04 12.7,67.56 3.05,67.56 1.78,68.83 1.78,70.48 2.73,71.44 GPIOC-JOY0.2
ZPC2
  Top 0.305: JOY0.3 13.72,24.77 15.24,26.29 15.24,66.55 12.89,68.9 GPIOC-JOY0.3
ZPC3
  Top 0.305: JOY0.2 3.79,22 1.27,25.02 1.27,64.77 2.79,66.29 5.02,66.29 GPIOC-JOY0.4
ZPC4
  Top 0.305: JOY0.9 6.88,28.96 11.81,28.96 13.21,30.35 13.21,61.98 11.37,63.82 GPIOC-JOY0.5
ZPD0  (via drill 0.6)
  Top 0.305: v55.88,48.01 ZPD0-RXD.2 | v66.67,83.44 72.64,83.44 74.8,85.6 v87.5,85.6
  Bottom 0.305: GPIOD-JOY1.1 31.37,47.88 53.47,47.88 v55.88,48.01 | ZPD0-RXD.2 59.94,83.44 v66.67,83.44 | v87.5,85.6 87.5,92.33 91.95,96.77 109.47,96.77 111.89,94.36 111.89,90.96 JOY1.5
ZPD1  (via drill 0.6)
  Top 0.305: v67.18,49.15 67.18,79.25 ZPD1-TXD.2 67.94,80.01 71.37,80.01 75.31,83.95 89.41,83.95 v92.2,86.74
  Bottom 0.305: GPIOD-JOY1.2 24.89,58.42 25.91,57.4 25.91,54.36 31.5,48.77 54.1,48.77 54.48,49.15 v67.18,49.15 | v92.2,86.74 107.44,86.74 108.18,87.48 JOY1.4
ZPD2  (via drill 0.6)
  Top 0.305: v92.46,49.53 92.46,69.98 94.87,72.39 97.41,72.39 103.38,78.36 103.38,83.57 105.41,85.6 JOY1.3
  Bottom 0.305: GPIOD-JOY1.3 24.51,60.96 26.54,58.93 26.54,54.86 31.88,49.53 53.98,49.53 54.99,50.42 68.33,50.42 91.06,50.29 v92.46,49.53
ZPD3  (via drill 0.6)
  Top 0.305: JOY1.2 102.62,90 102.62,78.74 96.9,73.03 94.49,73.03 91.95,70.48 91.95,53.47 v90.81,52.32 | v50.55,50.42 52.2,52.07 v52.2,52.2
  Bottom 0.305: GPIOD-JOY1.4 24.26,63.5 27.3,60.45 27.3,55.5 32.26,50.42 v50.55,50.42 | v52.2,52.2 52.32,52.32 v90.81,52.32
ZPD4  (via drill 0.6)
  Top 0.305: v93.47,51.31 93.47,70.1 95.25,71.88 97.79,71.88 104.01,78.11 104.01,83.31 104.52,83.82 108.58,83.82 109.56,84.8 JOY1.9
  Bottom 0.305: GPIOD-JOY1.5 24.51,66.04 26.29,64.26 26.29,62.48 28.07,60.71 28.07,55.88 32.51,51.31 v93.47,51.31
ZPD6_DATA  (via drill 0.6)
  Top 0.305: v125.09,13.46 v125.09,52.45 | v54.1,55.12 51.69,57.53 51.69,66.8 53.09,68.2 53.09,69.47 54.23,70.61 54.61,70.61 v54.61,73.03 | v58.67,75.06 59.31,75.69 59.31,84.96 59.05,85.22 46.74,85.22 41.88,90.07 PS/2KEYB.1
  Bottom 0.305: PS2KEYB.4 134.62,6.35 133.48,7.49 125.73,7.49 125.09,8.26 v125.09,13.46 | v125.09,52.45 122.43,55.12 v54.1,55.12 | v54.61,73.03 56.64,75.06 v58.67,75.06
ZPD7_CLK  (via drill 0.6)
  Top 0.305: PS2KEYB.1 123.19,7.62 v123.19,52.32 | v49.91,53.85 48.13,55.63 48.13,65.41 47.37,66.17 v46.23,67.82 | v45.72,70.99 v50.04,75.31 | v50.16,79.38 39.78,89.76 PS/2KEYB.5
  Bottom 0.305: v123.19,52.32 121.67,53.85 v49.91,53.85 | v46.23,67.82 45.72,69.85 v45.72,70.99 | v50.04,75.31 50.16,75.44 v50.16,79.38

### Text on the board
tPlace: 1 | 1 | 1 | G / +5 / nc | 1 | 1 | 1 | VHGRGB | 1 | 1 | 1 | Zikzak | Zikshield for ZZr3 rev 1 / Jeff Mitchell 2016 / www.zikzak.ca | 1 | 1 | 1 | 1 | 1